# Altium schematic sheet Sheet1.SchDoc
size 420 x 297 mm; SheetNumber: 1; SheetTotal: 1; ENG_APP_DATE: --/--/--; DSN_APP_DATE: --/--/--; CHK_APP_DATE: --/--/--
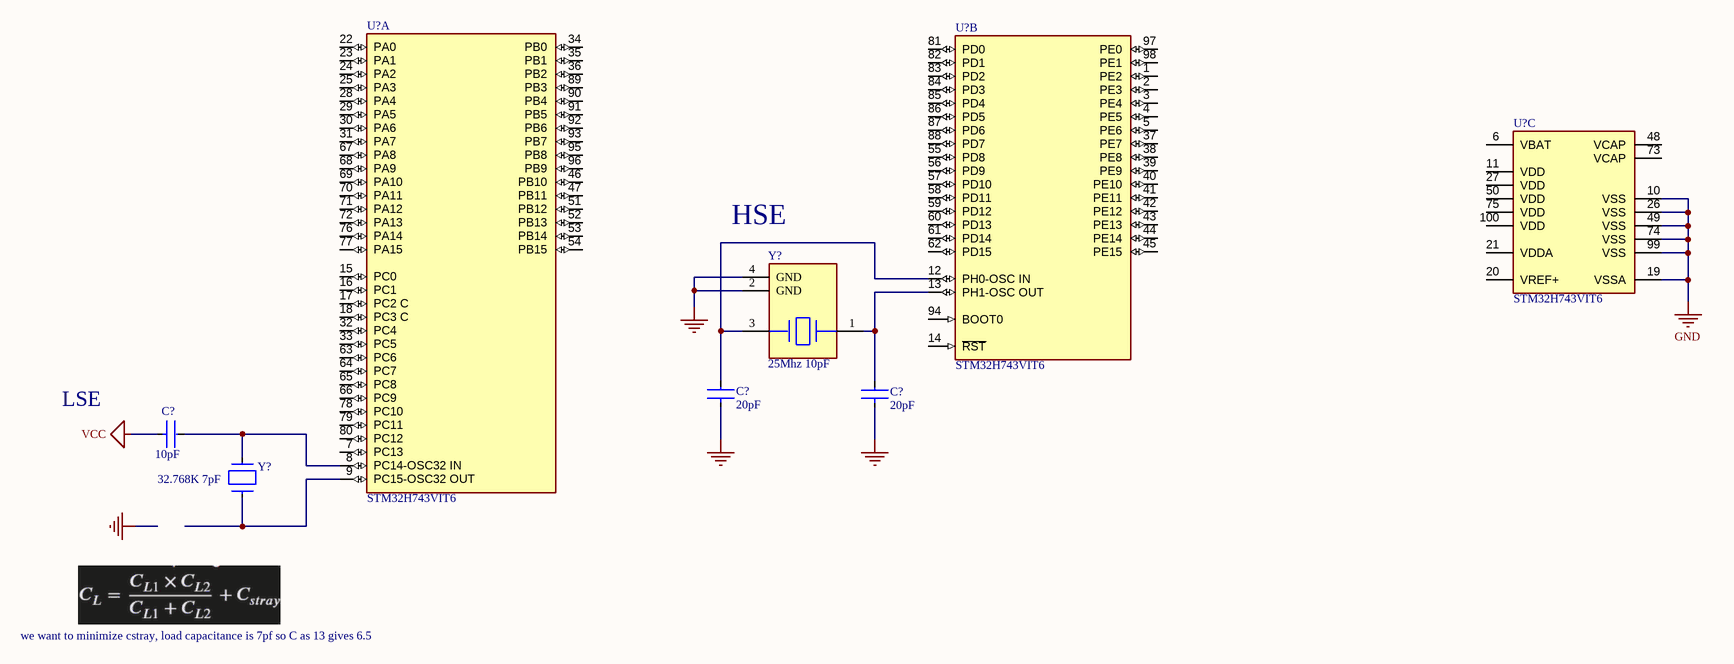
[diagram p0: Sheet1.SchDoc]

## Parts
(Parts that share a designator on the sheet are numbered #1, #2 ... from top to bottom, then left to right.)
C?#1  value 20pF  [FP-GCM155-0_05-IPC_C]  (hidden comment: GCM1555C1H200GA16D)
C?#2  value 20pF  [FP-GCM155-0_05-IPC_C]  (hidden comment: GCM1555C1H200GA16D)
C?#3  value 10pF  [FP-GCM188-0_1-IPC_C]  (hidden comment: GCM1885G2A100JA16D)
U?#1  STM32H743VIT6  [FP-LQFP100-1L-MFG]  (part A of 3)
U?#2  STM32H743VIT6  [FP-LQFP100-1L-MFG]  (part B of 3)
U?#3  STM32H743VIT6  [FP-LQFP100-1L-MFG]  (part C of 3)
Y?#1  25Mhz 10pF  [FP-ABM8-MFG]
Y?#2  32.768K 7pF  [FP-ABS09-MFG]

## Nets
GND: C?#1.1 C?#2.1 U?#3.10(VSS) U?#3.19(VSSA) U?#3.26(VSS) U?#3.49(VSS) U?#3.74(VSS) U?#3.99(VSS) Y?#1.2(GND) Y?#1.4(GND)
VCC: C?#3.1
NetC?#1_2: C?#1.2 U?#2.12(PH0-OSC_IN) Y?#1.3
NetC?#2_2: C?#2.2 U?#2.13(PH1-OSC_OUT) Y?#1.1
NetC?#3_2: C?#3.2 U?#1.8(PC14-OSC32_IN) Y?#2.2
NetU?#1_9: U?#1.9(PC15-OSC32_OUT) Y?#2.1

Not connected (* = marked no-connect by the designer): U?#1 7(PC13) 15(PC0) 16(PC1) 17(PC2_C) 18(PC3_C) 22(PA0) 23(PA1) 24(PA2) 25(PA3) 28(PA4) 29(PA5) 30(PA6) 31(PA7) 32(PC4) 33(PC5) 34(PB0) 35(PB1) 36(PB2) 46(PB10) 47(PB11) 51(PB12) 52(PB13) 53(PB14) 54(PB15) 63(PC6) 64(PC7) 65(PC8) 66(PC9) 67(PA8) 68(PA9) 69(PA10) 70(PA11) 71(PA12) 72(PA13) 76(PA14) 77(PA15) 78(PC10) 79(PC11) 80(PC12) 89(PB3) 90(PB4) 91(PB5) 92(PB6) 93(PB7) 95(PB8) 96(PB9); U?#2 1(PE2) 2(PE3) 3(PE4) 4(PE5) 5(PE6) 14(~{RST}) 37(PE7) 38(PE8) 39(PE9) 40(PE10) 41(PE11) 42(PE12) 43(PE13) 44(PE14) 45(PE15) 55(PD8) 56(PD9) 57(PD10) 58(PD11) 59(PD12) 60(PD13) 61(PD14) 62(PD15) 81(PD0) 82(PD1) 83(PD2) 84(PD3) 85(PD4) 86(PD5) 87(PD6) 88(PD7) 94(BOOT0) 97(PE0) 98(PE1); U?#3 6(VBAT) 11(VDD) 20(VREF+) 21(VDDA) 27(VDD) 48(VCAP) 50(VDD) 73(VCAP) 75(VDD) 100(VDD)

## Notes on the sheet
- (near Y?#1) HSE
- LSE
- we want to minimize cstray, load capacitance is 7pf so C as 13 gives 6.5
- THIS DOCUMENT AND THE DATA DISCLOSED HEREIN OR
- HEREWITH IS THE PROPERTY OF ALTIUM LIMITED AND MAY
- DWG NO:
- REVISION
- REV:
- DESCRIPTION
- DATE
- APPROVED
- BE FREELY DISTRIBUTED IN WHOLE. NO RIGHTS ARE
- RESERVED OR EXPRESS OR IMPLIED WARANTEE GIVEN.
- ENG:
- APPROVALS
- PROJECT
- DSN:
- CHK:
- REFERENCE DOCUMENTS
- PROJECT REVISION:
- TITLE
- DOCUMENT REVISION:
- DESIGN ITEM:
- BOM:
- FAB DWG:
- PCB DWG:
- ASSY DWG:
- SCALE:
- A3
- SIZE
- CAGE CODE
- FILE NAME
- DWG NO.
- SHEET
- OF
- REV

## Library data of the parts
C?#1 C?#2 = CMP-06035-011115-1: Ceramic Capacitor for Automotive 20pF ±2% 50VDC C0G 0402 Paper T/R
C?#3 = CMP-06035-042496-1: Ceramic Capacitor for Automotive 10pF  ±5% 100VDC X8G 0603 Paper T/R
U?#1-U?#3 = CMP-12105-000050-1: IC MCU 32BIT 2MB FLASH 100LQFP; Manufacturer: STMicroelectronics; Number Of Ethernet Channels: 1; Number Of Usb Channels: 2; Number Of A/D Converters: 3; Min Supply Voltage: 1.71V; Ram Size: 1060KBytes; Description: ARM® Cortex®-M7 STM32H7 Microcontroller IC 32-Bit 400MHz 2MB (2M x 8) FLASH 100-LQFP (14x14); Number Of I2C Channels: 4; Frequency: 480MHz; Number Of Adc Channels: 36; Number Of I/Os: 82; Max Supply Voltage: 3.6V; Number Of Spi Channels: 6; Memory Size: 2MBytes; Max Junction Temp: +125°C; Core Architecture: Arm Cortex-M7; Interface: I2C,SPI,UART,USART,USB,LIN,IrDA,Ethernet,I2S,Other; Number Of Timers/Counters: 20; Data Bus Width: 32bits; Number Of Pwm Channels: 42; Number Of Uart Channels: 9; Standoff Height: 0.05mm; Device Class L1: Integrated Circuits (ICs); ComponentLink2URL: https://www.st.com/resource/en/datasheet/stm32h743vi.pdf; Automotive: No; Memory Type: FLASH; Number Of Cores: 1; Temperature Range Low: -40°C; RoHS: TRUE; Ambient Temperature Range Low: -40°C; ComponentLink2Description: Datasheet; Device Class L2: Embedded Processors and Controllers; Device Class L3: Microcontrollers; Digikey Description: IC MCU 32BIT 2MB FLASH 100LQFP; Temperature Range High: +125°C; Ambient Temperature Range High: +85°C; Package: LQFP100-1L; Temperature: -40°C to +125°C; Category: IC; Ipc Land Pattern Name: QFP50P1600X1600X160-100; Height: 1.6mm; Manufacturer Part Number: STM32H743VIT6; Octopart: https://octopart.com/stm32h743vit6-stmicroelectronics-76372527; Lead Free: Yes
Y?#1 = CMP-27762-006353-1: Crystal 25MHz ±10ppm 10pF SMD-4 3.2mm x 2.5mm
Y?#2 = CMP-27762-002676-1: CRYSTAL 32.7680KHZ 7PF SMD; ESR (Equivalent Series Resistance): 70kR; Frequency: 32.768kHz; Frequency Tolerance: 20ppm; Operating Frequency: 32.768 kHz; Series: ABS09; Lead Free: Lead Free; Number of Pins: 2; Length: 0.161inch; RoHS Compliant: Yes; Width: 1.5mm; Mount: Surface Mount; Packaging: Tape and Reel; Case/Package: SMD/SMT; Series Resistance: 70kR; Package Quantity: 3000; Min Operating Temperature: -40°C; Height: 0.035inch; Max Operating Temperature: 85°C; Tolerance: 20ppm; Termination: SMD/SMT; Frequency Stability: 20ppm; Load Capacitance: 7pF